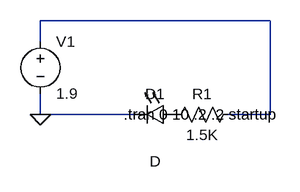
[diagram p0: schematic LED test circuit feb27.asc]
LED test circuit feb27.asc, the LTspice schematic file:
Version 4
SHEET 1 880 680
WIRE 400 16 48 16
WIRE 48 48 48 16
WIRE 48 160 48 128
WIRE 192 160 48 160
WIRE 400 160 400 16
WIRE 400 160 336 160
FLAG 48 160 0
SYMBOL LED 256 144 R90
WINDOW 0 0 32 VBottom 2
WINDOW 3 72 32 VTop 2
SYMATTR InstName D1
SYMBOL res 352 144 R90
WINDOW 0 0 56 VBottom 2
WINDOW 3 32 56 VTop 2
SYMATTR InstName R1
SYMATTR Value 1.5K
SYMATTR SpiceLine tol=1 pwr=0.1
SYMBOL voltage 48 32 R0
WINDOW 123 0 0 Left 2
WINDOW 39 24 106 Left 2
SYMATTR InstName V1
SYMATTR Value 1.9
TEXT 176 160 Left 2 !.tran 0 10 .2 .2 startup

The netlist it stands for:
* LED test circuit feb27.asc
D1 P001 0 D
R1 N001 P001 1.5K tol=1 pwr=0.1
V1 N001 0 1.9
.model D D
.lib standard.dio
.tran 0 10 .2 .2 startup
.backanno
.end